# EAGLE schematic bp_to_avr (EAGLE 6.3)
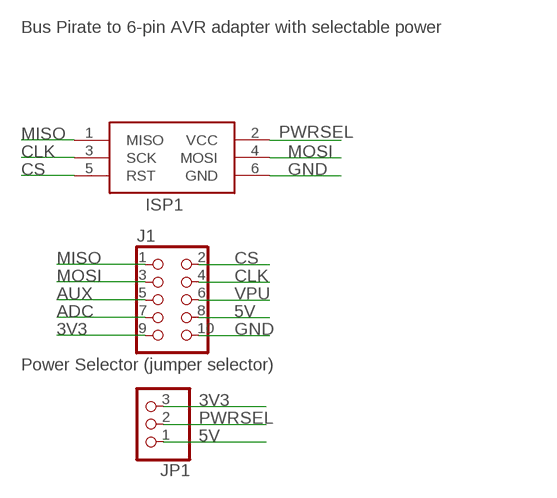
[diagram p0: schematic, sheet 1]

## Parts
ISP1  AVRISP-6  [AVRISP]
J1  CON_HEADER_2X05-PTH+SHROUDED_B  [PINSHRD_PTH_2X05B]
JP1  PINHD-1X3  [1X03]

## Nets
3V3: J1.9 JP1.3
5V: J1.8 JP1.1
ADC: J1.7
AUX: J1.5
CLK: ISP1.3(SCK) J1.4
CS: ISP1.5(RST) J1.2
GND: ISP1.6(GND) J1.10
MISO: ISP1.1(MISO) J1.1
MOSI: ISP1.4(MOSI) J1.3
PWRSEL: ISP1.2(VCC) JP1.2
VPU: J1.6

## Notes on the sheet
- Bus Pirate to 6-pin AVR adapter with selectable power
- Power Selector (jumper selector)

## Library data of the parts
ISP1 = adafruit:AVRISP: AVR ISP HEADER Standard 6 pin header for AVR programming
J1 = dp_devices:CON_HEADER_2X05: 2x05 pin header
JP1 = adafruit:PINHD-1X3: PIN HEADER